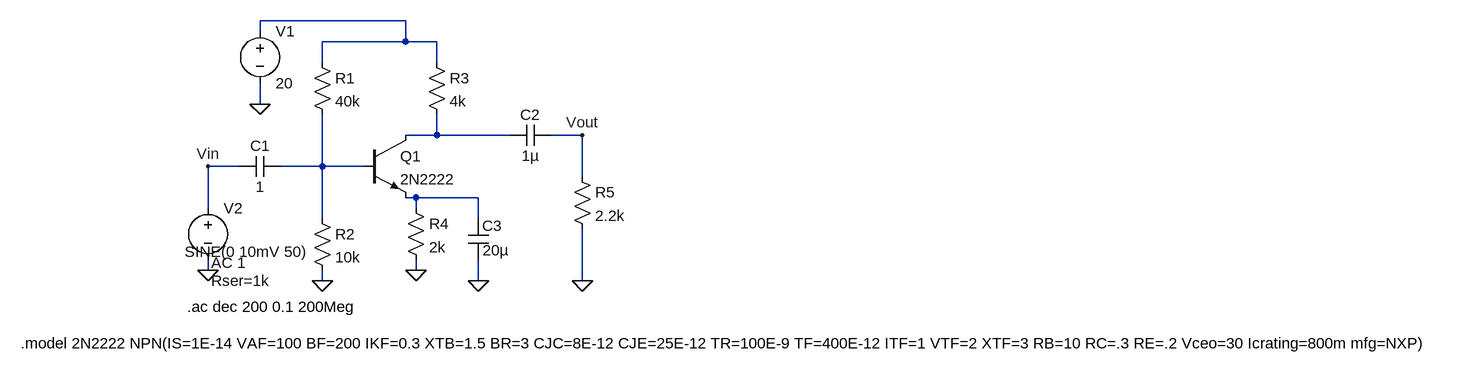
[diagram p0: schematic BJT Amplifier.asc]
BJT Amplifier.asc, the LTspice schematic file:
Version 4.1
SHEET 1 2192 680
WIRE 208 -48 -16 -48
WIRE -16 -32 -16 -48
WIRE 208 -16 208 -48
WIRE 208 -16 80 -16
WIRE 256 -16 208 -16
WIRE 80 16 80 -16
WIRE 256 16 256 -16
WIRE -16 80 -16 48
WIRE 256 128 256 96
WIRE 256 128 208 128
WIRE 368 128 256 128
WIRE 480 128 432 128
WIRE -48 176 -96 176
WIRE 80 176 80 96
WIRE 80 176 16 176
WIRE 144 176 80 176
WIRE 480 192 480 128
WIRE 224 224 208 224
WIRE 320 224 224 224
WIRE -96 240 -96 176
WIRE 224 240 224 224
WIRE 80 256 80 176
WIRE 320 256 320 224
WIRE -96 336 -96 320
WIRE 224 336 224 320
WIRE 80 352 80 336
WIRE 320 352 320 320
WIRE 480 352 480 272
FLAG -96 336 0
FLAG 80 352 0
FLAG 224 336 0
FLAG 320 352 0
FLAG 480 352 0
FLAG -16 80 0
FLAG -96 176 Vin
FLAG 480 128 Vout
SYMBOL npn 144 128 R0
SYMATTR InstName Q1
SYMATTR Value 2N2222
SYMBOL cap 16 160 R90
WINDOW 0 0 32 VBottom 2
WINDOW 3 32 32 VTop 2
SYMATTR InstName C1
SYMATTR Value 1
SYMBOL cap 432 112 R90
WINDOW 0 0 32 VBottom 2
WINDOW 3 32 32 VTop 2
SYMATTR InstName C2
SYMATTR Value 1µ
SYMBOL cap 336 320 R180
WINDOW 0 -21 53 Left 2
WINDOW 3 -31 15 Left 2
SYMATTR InstName C3
SYMATTR Value 20µ
SYMBOL voltage -16 -48 R0
SYMATTR InstName V1
SYMATTR Value 20
SYMBOL voltage -96 224 R0
WINDOW 3 -36 83 Left 2
WINDOW 123 5 100 Left 2
WINDOW 39 5 128 Left 2
SYMATTR InstName V2
SYMATTR Value SINE(0 10mV 50)
SYMATTR Value2 AC 1
SYMATTR SpiceLine Rser=1k
SYMBOL res 64 0 R0
SYMATTR InstName R1
SYMATTR Value 40k
SYMBOL res 64 240 R0
SYMATTR InstName R2
SYMATTR Value 10k
SYMBOL res 240 0 R0
SYMATTR InstName R3
SYMATTR Value 4k
SYMBOL res 208 224 R0
SYMATTR InstName R4
SYMATTR Value 2k
SYMBOL res 464 176 R0
SYMATTR InstName R5
SYMATTR Value 2.2k
TEXT -128 392 Left 2 !.ac dec 200 0.1 200Meg
TEXT -384 448 Left 2 !.model 2N2222 NPN(IS=1E-14 VAF=100 BF=200 IKF=0.3 XTB=1.5 BR=3 CJC=8E-12 CJE=25E-12 TR=100E-9 TF=400E-12 ITF=1 VTF=2 XTF=3 RB=10 RC=.3 RE=.2 Vceo=30 Icrating=800m mfg=NXP)

The netlist it stands for:
* BJT Amplifier.asc
Q1 N002 N003 N004 0 2N2222
C1 N003 Vin 1
C2 Vout N002 1µ
C3 0 N004 20µ
V1 N001 0 20
V2 Vin 0 SINE(0 10mV 50) AC 1 Rser=1k
R1 N001 N003 40k
R2 N003 0 10k
R3 N001 N002 4k
R4 N004 0 2k
R5 Vout 0 2.2k
.model NPN NPN
.model PNP PNP
.lib standard.bjt
.ac dec 200 0.1 200Meg
.model 2N2222 NPN(IS=1E-14 VAF=100 BF=200 IKF=0.3 XTB=1.5 BR=3 CJC=8E-12 CJE=25E-12 TR=100E-9 TF=400E-12 ITF=1 VTF=2 XTF=3 RB=10 RC=.3 RE=.2 Vceo=30 Icrating=800m mfg=NXP)
.backanno
.end